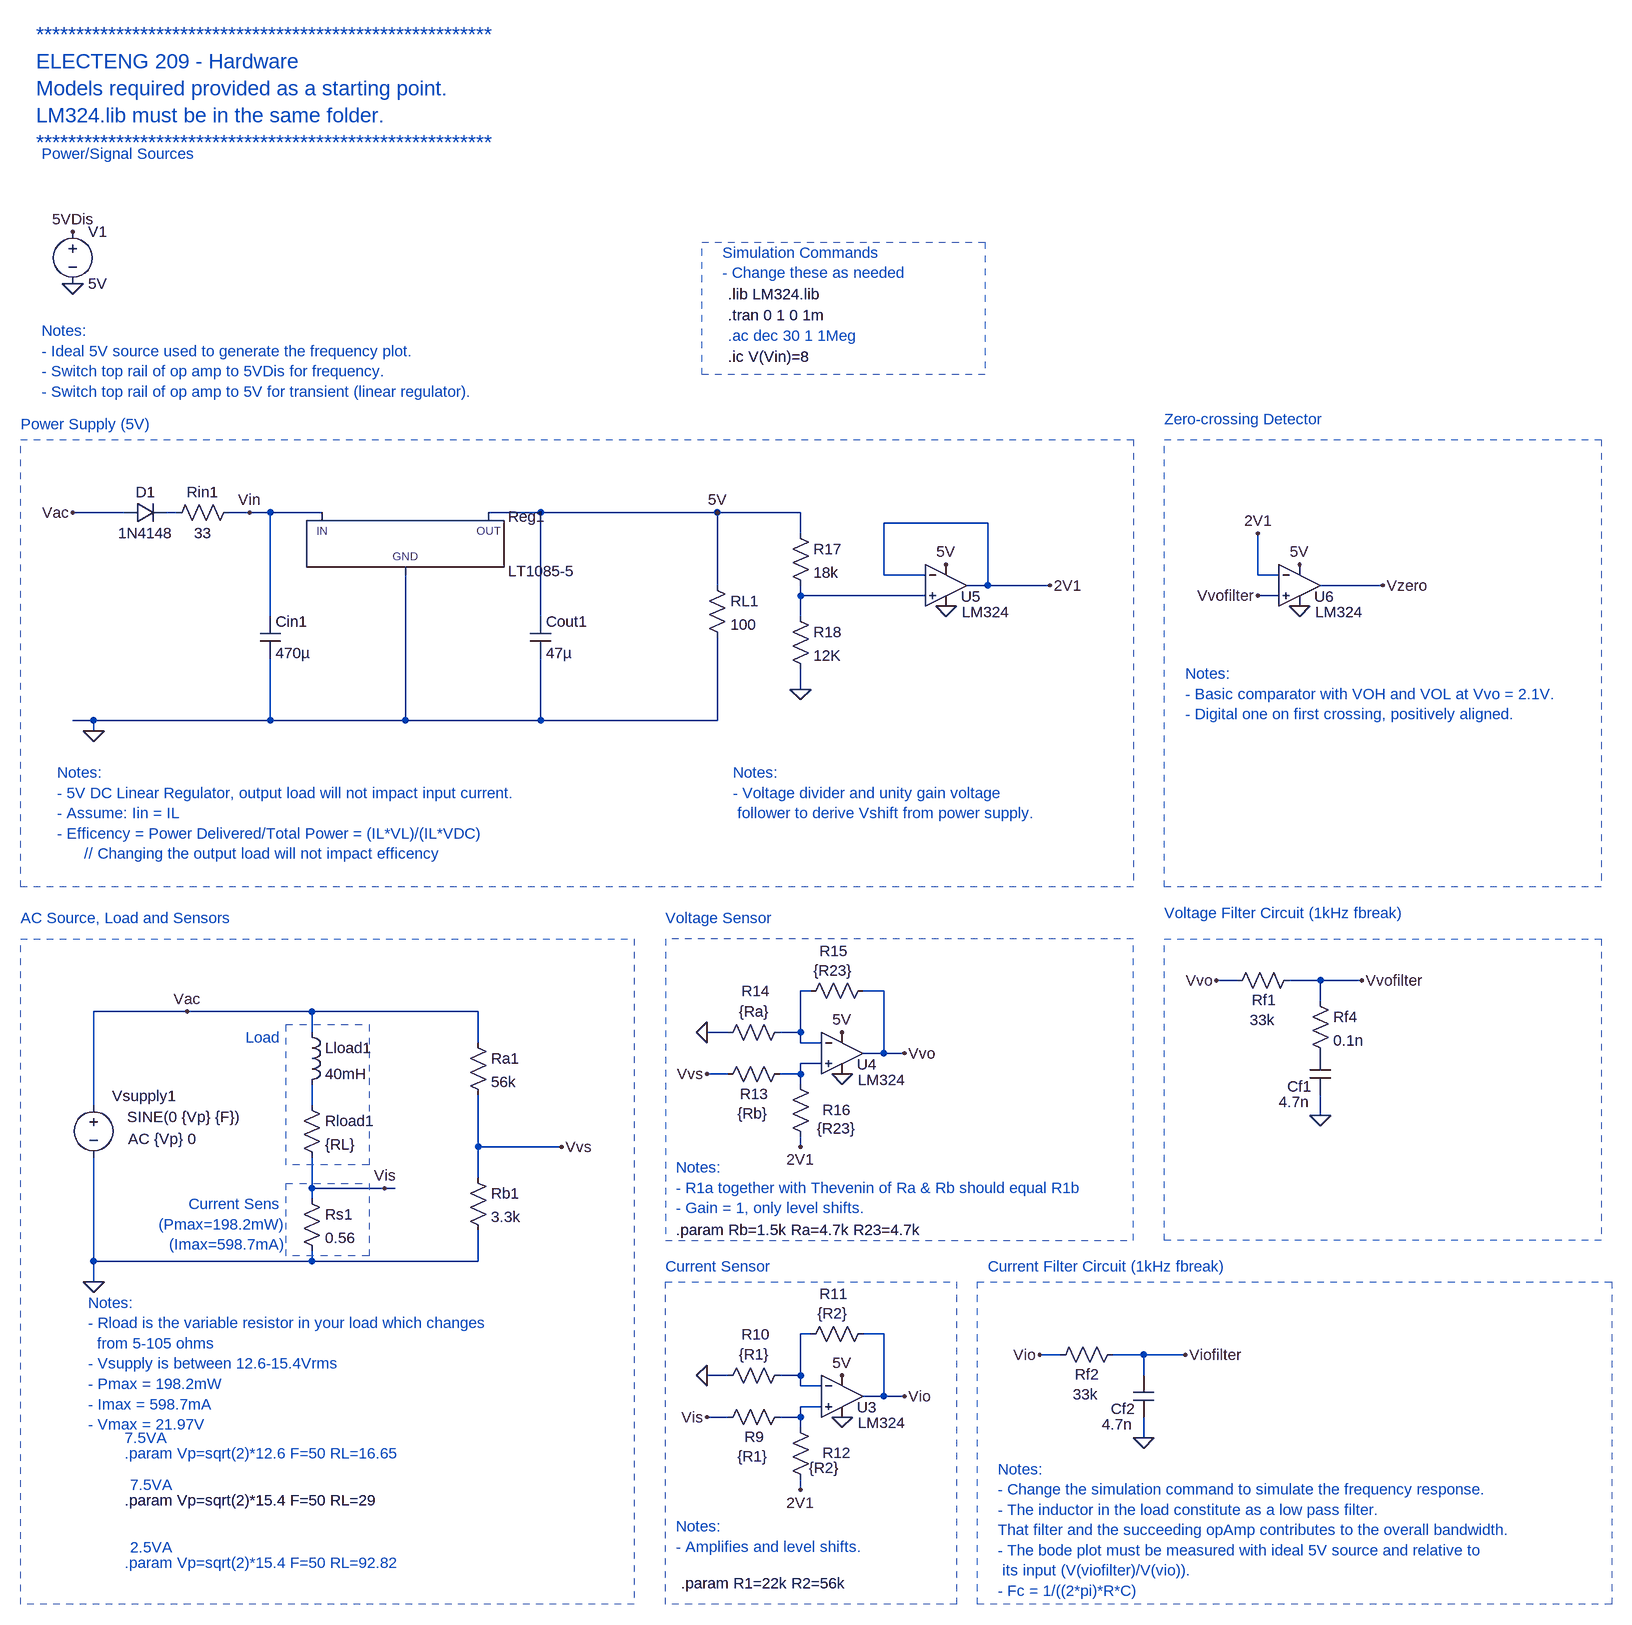
[diagram p0: schematic Hardware.asc]
Hardware.asc, the LTspice schematic file:
Version 4
SHEET 1 3756 1488
WIRE -1072 -288 -1152 -288
WIRE -992 -288 -1008 -288
WIRE -880 -288 -912 -288
WIRE -848 -288 -880 -288
WIRE -768 -288 -848 -288
WIRE -432 -288 -512 -288
WIRE -160 -288 -432 -288
WIRE -32 -288 -160 -288
WIRE 256 -272 96 -272
WIRE -32 -256 -32 -288
WIRE 96 -192 96 -272
WIRE 160 -192 96 -192
WIRE 672 -192 672 -256
WIRE 704 -192 672 -192
WIRE -160 -176 -160 -288
WIRE 256 -176 256 -272
WIRE 256 -176 224 -176
WIRE 352 -176 256 -176
WIRE 864 -176 768 -176
WIRE -32 -160 -32 -176
WIRE 160 -160 -32 -160
WIRE 704 -160 672 -160
WIRE -848 -128 -848 -288
WIRE -432 -128 -432 -288
WIRE -32 -128 -32 -160
WIRE -32 -16 -32 -48
WIRE -1120 32 -1152 32
WIRE -848 32 -848 -64
WIRE -848 32 -1120 32
WIRE -640 32 -640 -192
WIRE -640 32 -848 32
WIRE -432 32 -432 -64
WIRE -432 32 -640 32
WIRE -160 32 -160 -96
WIRE -160 32 -432 32
WIRE -1120 48 -1120 32
WIRE 640 432 608 432
WIRE 768 432 720 432
WIRE 832 432 768 432
WIRE -16 448 -32 448
WIRE 96 448 64 448
WIRE 768 464 768 432
WIRE -976 480 -1120 480
WIRE -784 480 -976 480
WIRE -528 480 -784 480
WIRE -784 512 -784 480
WIRE -144 512 -176 512
WIRE -32 512 -32 448
WIRE -32 512 -64 512
WIRE -528 528 -528 480
WIRE -32 528 -32 512
WIRE 0 528 -32 528
WIRE 96 544 96 448
WIRE 96 544 64 544
WIRE 128 544 96 544
WIRE 0 560 -32 560
WIRE -144 576 -176 576
WIRE -32 576 -32 560
WIRE -32 576 -64 576
WIRE -32 592 -32 576
WIRE -1120 624 -1120 480
WIRE -784 624 -784 592
WIRE 768 640 768 608
WIRE -528 688 -528 608
WIRE -400 688 -528 688
WIRE -32 688 -32 672
WIRE -528 736 -528 688
WIRE -784 752 -784 704
WIRE -672 752 -784 752
WIRE -656 752 -672 752
WIRE -784 768 -784 752
WIRE -1120 864 -1120 704
WIRE -784 864 -784 848
WIRE -784 864 -1120 864
WIRE -528 864 -528 816
WIRE -528 864 -784 864
WIRE -1120 896 -1120 864
WIRE -16 976 -32 976
WIRE 96 976 64 976
WIRE 368 1008 336 1008
WIRE 496 1008 448 1008
WIRE 560 1008 496 1008
WIRE -144 1040 -176 1040
WIRE -32 1040 -32 976
WIRE -32 1040 -64 1040
WIRE 496 1040 496 1008
WIRE -32 1056 -32 1040
WIRE 0 1056 -32 1056
WIRE 96 1072 96 976
WIRE 96 1072 64 1072
WIRE 128 1072 96 1072
WIRE 0 1088 -32 1088
WIRE -144 1104 -176 1104
WIRE -32 1104 -32 1088
WIRE -32 1104 -64 1104
WIRE -32 1120 -32 1104
WIRE 496 1136 496 1104
WIRE -32 1216 -32 1200
FLAG -1152 -640 0
FLAG -1120 896 0
FLAG -1152 -720 5VDis
FLAG -976 480 Vac
FLAG -1120 48 0
FLAG -672 752 Vis
FLAG 32 1104 0
FLAG 32 1040 5V
FLAG -176 1104 Vis
FLAG -176 1040 0
FLAG 128 1072 Vio
FLAG -32 1216 2V1
FLAG 32 576 0
FLAG 32 512 5V
FLAG -176 512 0
FLAG 128 544 Vvo
FLAG -32 688 2V1
FLAG -1152 -288 Vac
FLAG -160 -288 5V
FLAG 768 640 0
FLAG 608 432 Vvo
FLAG 832 432 Vvofilter
FLAG -880 -288 Vin
FLAG -400 688 Vvs
FLAG -176 576 Vvs
FLAG 352 -176 2V1
FLAG -32 -16 0
FLAG 192 -144 0
FLAG 192 -208 5V
FLAG 736 -144 0
FLAG 736 -208 5V
FLAG 864 -176 Vzero
FLAG 672 -160 Vvofilter
FLAG 672 -256 2V1
FLAG 496 1136 0
FLAG 336 1008 Vio
FLAG 560 1008 Viofilter
SYMBOL voltage -1152 -736 R0
WINDOW 123 0 0 Left 0
WINDOW 39 0 0 Left 0
SYMATTR InstName V1
SYMATTR Value 5V
SYMBOL voltage -1120 608 R0
WINDOW 0 29 2 Left 2
WINDOW 3 52 34 Left 2
WINDOW 123 53 68 Left 2
WINDOW 39 0 0 Left 0
SYMATTR InstName Vsupply1
SYMATTR Value SINE(0 {Vp} {F})
SYMATTR Value2 AC {Vp} 0
SYMBOL PowerProducts/LT1085-5 -640 -288 R0
SYMATTR InstName Reg1
SYMBOL res -176 -192 R0
SYMATTR InstName RL1
SYMATTR Value 100
SYMBOL res -896 -304 R90
WINDOW 0 0 56 VBottom 2
WINDOW 3 32 56 VTop 2
SYMATTR InstName Rin1
SYMATTR Value 33
SYMBOL diode -1072 -272 R270
WINDOW 0 32 32 VTop 2
WINDOW 3 0 32 VBottom 2
SYMATTR InstName D1
SYMATTR Value 1N4148
SYMBOL cap -864 -128 R0
SYMATTR InstName Cin1
SYMATTR Value 470µ
SYMATTR SpiceLine Rser=0.001
SYMBOL cap -448 -128 R0
SYMATTR InstName Cout1
SYMATTR Value 47µ
SYMATTR SpiceLine Rser=0.001
SYMBOL res -800 608 R0
SYMATTR InstName Rload1
SYMATTR Value {RL}
SYMBOL ind -800 496 R0
SYMATTR InstName Lload1
SYMATTR Value 40mH
SYMBOL res -800 752 R0
SYMATTR InstName Rs1
SYMATTR Value 0.56
SYMBOL res -544 512 R0
SYMATTR InstName Ra1
SYMATTR Value 56k
SYMBOL res -544 720 R0
SYMATTR InstName Rb1
SYMATTR Value 3.3k
SYMBOL Opamps/opamp2 32 1008 R0
WINDOW 0 23 81 Left 2
WINDOW 3 24 105 Left 2
SYMATTR InstName U3
SYMATTR Value LM324
SYMBOL res -48 1088 R90
WINDOW 0 62 55 VBottom 2
WINDOW 3 61 57 VTop 2
SYMATTR InstName R9
SYMATTR Value {R1}
SYMBOL res -48 1024 R90
WINDOW 0 -32 53 VBottom 2
WINDOW 3 -32 55 VTop 2
SYMATTR InstName R10
SYMATTR Value {R1}
SYMBOL res 80 960 R90
WINDOW 0 -30 61 VBottom 2
WINDOW 3 -31 62 VTop 2
SYMATTR InstName R11
SYMATTR Value {R2}
SYMBOL res -16 1216 R180
WINDOW 0 -62 57 Left 2
WINDOW 3 -44 34 Left 2
SYMATTR InstName R12
SYMATTR Value {R2}
SYMBOL Opamps/opamp2 32 480 R0
WINDOW 0 23 81 Left 2
WINDOW 3 24 105 Left 2
SYMATTR InstName U4
SYMATTR Value LM324
SYMBOL res -48 560 R90
WINDOW 0 62 55 VBottom 2
WINDOW 3 61 57 VTop 2
SYMATTR InstName R13
SYMATTR Value {Rb}
SYMBOL res -48 496 R90
WINDOW 0 -32 53 VBottom 2
WINDOW 3 -32 55 VTop 2
SYMATTR InstName R14
SYMATTR Value {Ra}
SYMBOL res 80 432 R90
WINDOW 0 -30 61 VBottom 2
WINDOW 3 -31 62 VTop 2
SYMATTR InstName R15
SYMATTR Value {R23}
SYMBOL res -16 688 R180
WINDOW 0 -62 57 Left 2
WINDOW 3 -70 28 Left 2
SYMATTR InstName R16
SYMATTR Value {R23}
SYMBOL res 736 416 R90
WINDOW 0 62 55 VBottom 2
WINDOW 3 61 57 VTop 2
SYMATTR InstName Rf1
SYMATTR Value 33k
SYMBOL cap 784 608 R180
WINDOW 0 29 13 Left 2
WINDOW 3 33 -11 Left 2
SYMATTR InstName Cf1
SYMATTR Value 4.7n
SYMBOL res -48 -272 R0
SYMATTR InstName R17
SYMATTR Value 18k
SYMBOL res -48 -144 R0
SYMATTR InstName R18
SYMATTR Value 12K
SYMBOL Opamps/opamp2 192 -240 R0
WINDOW 0 23 81 Left 2
WINDOW 3 24 105 Left 2
SYMATTR InstName U5
SYMATTR Value LM324
SYMBOL Opamps/opamp2 736 -240 R0
WINDOW 0 23 81 Left 2
WINDOW 3 24 105 Left 2
SYMATTR InstName U6
SYMATTR Value LM324
SYMBOL res 464 992 R90
WINDOW 0 62 55 VBottom 2
WINDOW 3 61 57 VTop 2
SYMATTR InstName Rf2
SYMATTR Value 33k
SYMBOL cap 512 1104 R180
WINDOW 0 29 13 Left 2
WINDOW 3 33 -11 Left 2
SYMATTR InstName Cf2
SYMATTR Value 4.7n
SYMBOL res 752 448 R0
SYMATTR InstName Rf4
SYMATTR Value 0.1n
TEXT -144 -560 Left 2 ;.ac dec 30 1 1Meg
TEXT -144 -624 Left 2 !.lib LM324.lib
TEXT -1200 -840 Left 2 ;Power/Signal Sources
TEXT -1208 -1024 Left 3 ;*********************************************************\nELECTENG 209 - Hardware\nModels required provided as a starting point.\nLM324.lib must be in the same folder.\n*********************************************************
TEXT -1232 336 Left 2 ;AC Source, Load and Sensors
TEXT -1200 -568 Left 2 ;Notes: \n- Ideal 5V source used to generate the frequency plot.\n- Switch top rail of op amp to 5VDis for frequency.\n- Switch top rail of op amp to 5V for transient (linear regulator).
TEXT -1128 928 Left 2 ;Notes: \n- Rload is the variable resistor in your load which changes \n  from 5-105 ohms \n- Vsupply is between 12.6-15.4Vrms\n- Pmax = 198.2mW\n- Imax = 598.7mA\n- Vmax = 21.97V
TEXT -832 520 Right 2 ;Load
TEXT -824 776 Right 2 ;Current Sens \n(Pmax=198.2mW)\n(Imax=598.7mA)
TEXT -152 -688 Left 2 ;Simulation Commands\n- Change these as needed
TEXT -240 872 Left 2 ;Current Sensor
TEXT -224 1272 Left 2 ;Notes: \n- Amplifies and level shifts.
TEXT -240 336 Left 2 ;Voltage Sensor
TEXT -224 720 Left 2 ;Notes: \n- R1a together with Thevenin of Ra & Rb should equal R1b\n- Gain = 1, only level shifts.
TEXT -1232 -424 Left 2 ;Power Supply (5V)
TEXT 528 328 Left 2 ;Voltage Filter Circuit (1kHz fbreak)
TEXT 272 1184 Left 2 ;Notes: \n- Change the simulation command to simulate the frequency response.\n- The inductor in the load constitute as a low pass filter. \nThat filter and the succeeding opAmp contributes to the overall bandwidth.\n- The bode plot must be measured with ideal 5V source and relative to\n its input (V(viofilter)/V(vio)).\n- Fc = 1/((2*pi)*R*C)
TEXT -144 -592 Left 2 !.tran 0 1 0 1m
TEXT -144 -528 Left 2 !.ic V(Vin)=8
TEXT -1176 112 Left 2 ;Notes: \n- 5V DC Linear Regulator, output load will not impact input current.\n- Assume: Iin = IL\n- Efficency = Power Delivered/Total Power = (IL*VL)/(IL*VDC) \n      // Changing the output load will not impact efficency
TEXT -216 1360 Left 2 !.param R1=22k R2=56k
TEXT -224 816 Left 2 !.param Rb=1.5k Ra=4.7k R23=4.7k
TEXT 528 -432 Left 2 ;Zero-crossing Detector
TEXT -1072 1160 Left 2 ;.param Vp=sqrt(2)*12.6 F=50 RL=16.65
TEXT -1072 1232 Left 2 !.param Vp=sqrt(2)*15.4 F=50 RL=29
TEXT -1072 1328 Left 2 ;.param Vp=sqrt(2)*15.4 F=50 RL=92.82
TEXT -1072 1136 Left 2 ;7.5VA
TEXT -1064 1208 Left 2 ;7.5VA
TEXT -1064 1304 Left 2 ;2.5VA
TEXT 256 872 Left 2 ;Current Filter Circuit (1kHz fbreak)
TEXT 560 -40 Left 2 ;Notes: \n- Basic comparator with VOH and VOL at Vvo = 2.1V.\n- Digital one on first crossing, positively aligned.
TEXT -136 112 Left 2 ;Notes: \n- Voltage divider and unity gain voltage\n follower to derive Vshift from power supply.
RECTANGLE Normal -824 500 -696 716 2
RECTANGLE Normal -824 744 -696 856 2
RECTANGLE Normal -184 -704 252 -500 2
RECTANGLE Normal -288 1392 -1232 368 1
RECTANGLE Normal 208 1392 -240 896 1
RECTANGLE Normal 480 288 -1232 -400 1
RECTANGLE Normal 1200 288 528 -400 1
RECTANGLE Normal 480 368 -240 832 1
RECTANGLE Normal 1216 1392 240 896 1
RECTANGLE Normal 1200 832 528 368 1

The netlist it stands for:
* Hardware.asc
V1 5VDis 0 5V
Vsupply1 Vac 0 SINE(0 {Vp} {F}) AC {Vp} 0
XReg1 0 5V Vin LT1085-5  ; pins GND OUT IN
RL1 5V 0 100
Rin1 Vin N001 33
D1 Vac N001 1N4148
Cin1 Vin 0 470µ Rser=0.001
Cout1 5V 0 47µ Rser=0.001
Rload1 N005 Vis {RL}
Lload1 Vac N005 40mH
Rs1 Vis 0 0.56
Ra1 Vac Vvs 56k
Rb1 Vvs 0 3.3k
XU3 N007 N006 5V 0 Vio LM324  ; pins In+ In- V+ V- OUT
R9 N007 Vis {R1}
R10 N006 0 {R1}
R11 Vio N006 {R2}
R12 2V1 N007 {R2}
XU4 N004 N003 5V 0 Vvo LM324  ; pins In+ In- V+ V- OUT
R13 N004 Vvs {Rb}
R14 N003 0 {Ra}
R15 Vvo N003 {R23}
R16 2V1 N004 {R23}
Rf1 Vvofilter Vvo 33k
Cf1 0 P001 4.7n
R17 5V N002 18k
R18 N002 0 12K
XU5 N002 2V1 5V 0 2V1 LM324  ; pins In+ In- V+ V- OUT
XU6 Vvofilter 2V1 5V 0 Vzero LM324  ; pins In+ In- V+ V- OUT
Rf2 Viofilter Vio 33k
Cf2 0 Viofilter 4.7n
Rf4 Vvofilter P001 0.1n
.model D D
.lib standard.dio
* .ac dec 30 1 1Meg
.lib LM324.lib
* Power/Signal Sources
* *********************************************************
* ELECTENG 209 - Hardware
* Models required provided as a starting point.
* LM324.lib must be in the same folder.
* *********************************************************
* AC Source, Load and Sensors
* Notes:
* - Ideal 5V source used to generate the frequency plot.
* - Switch top rail of op amp to 5VDis for frequency.
* - Switch top rail of op amp to 5V for transient (linear regulator).
* Notes:
* - Rload is the variable resistor in your load which changes
*   from 5-105 ohms
* - Vsupply is between 12.6-15.4Vrms
* - Pmax = 198.2mW
* - Imax = 598.7mA
* - Vmax = 21.97V
* Load
* Current Sens
* (Pmax=198.2mW)
* (Imax=598.7mA)
* Simulation Commands
* - Change these as needed
* Current Sensor
* Notes:
* - Amplifies and level shifts.
* Voltage Sensor
* Notes:
* - R1a together with Thevenin of Ra & Rb should equal R1b
* - Gain = 1, only level shifts.
* Power Supply (5V)
* Voltage Filter Circuit (1kHz fbreak)
* Notes:
* - Change the simulation command to simulate the frequency response.
* - The inductor in the load constitute as a low pass filter.
* That filter and the succeeding opAmp contributes to the overall bandwidth.
* - The bode plot must be measured with ideal 5V source and relative to
*  its input (V(viofilter)/V(vio)).
* - Fc = 1/((2*pi)*R*C)
.tran 0 1 0 1m
.ic V(Vin)=8
* Notes:
* - 5V DC Linear Regulator, output load will not impact input current.
* - Assume: Iin = IL
* - Efficency = Power Delivered/Total Power = (IL*VL)/(IL*VDC)
*       // Changing the output load will not impact efficency
.param R1=22k R2=56k
.param Rb=1.5k Ra=4.7k R23=4.7k
* Zero-crossing Detector
* .param Vp=sqrt(2)*12.6 F=50 RL=16.65
.param Vp=sqrt(2)*15.4 F=50 RL=29
* .param Vp=sqrt(2)*15.4 F=50 RL=92.82
* 7.5VA
* 7.5VA
* 2.5VA
* Current Filter Circuit (1kHz fbreak)
* Notes:
* - Basic comparator with VOH and VOL at Vvo = 2.1V.
* - Digital one on first crossing, positively aligned.
* Notes:
* - Voltage divider and unity gain voltage
*  follower to derive Vshift from power supply.
.backanno
.end